# EAGLE schematic smps test (EAGLE 7.2.0)
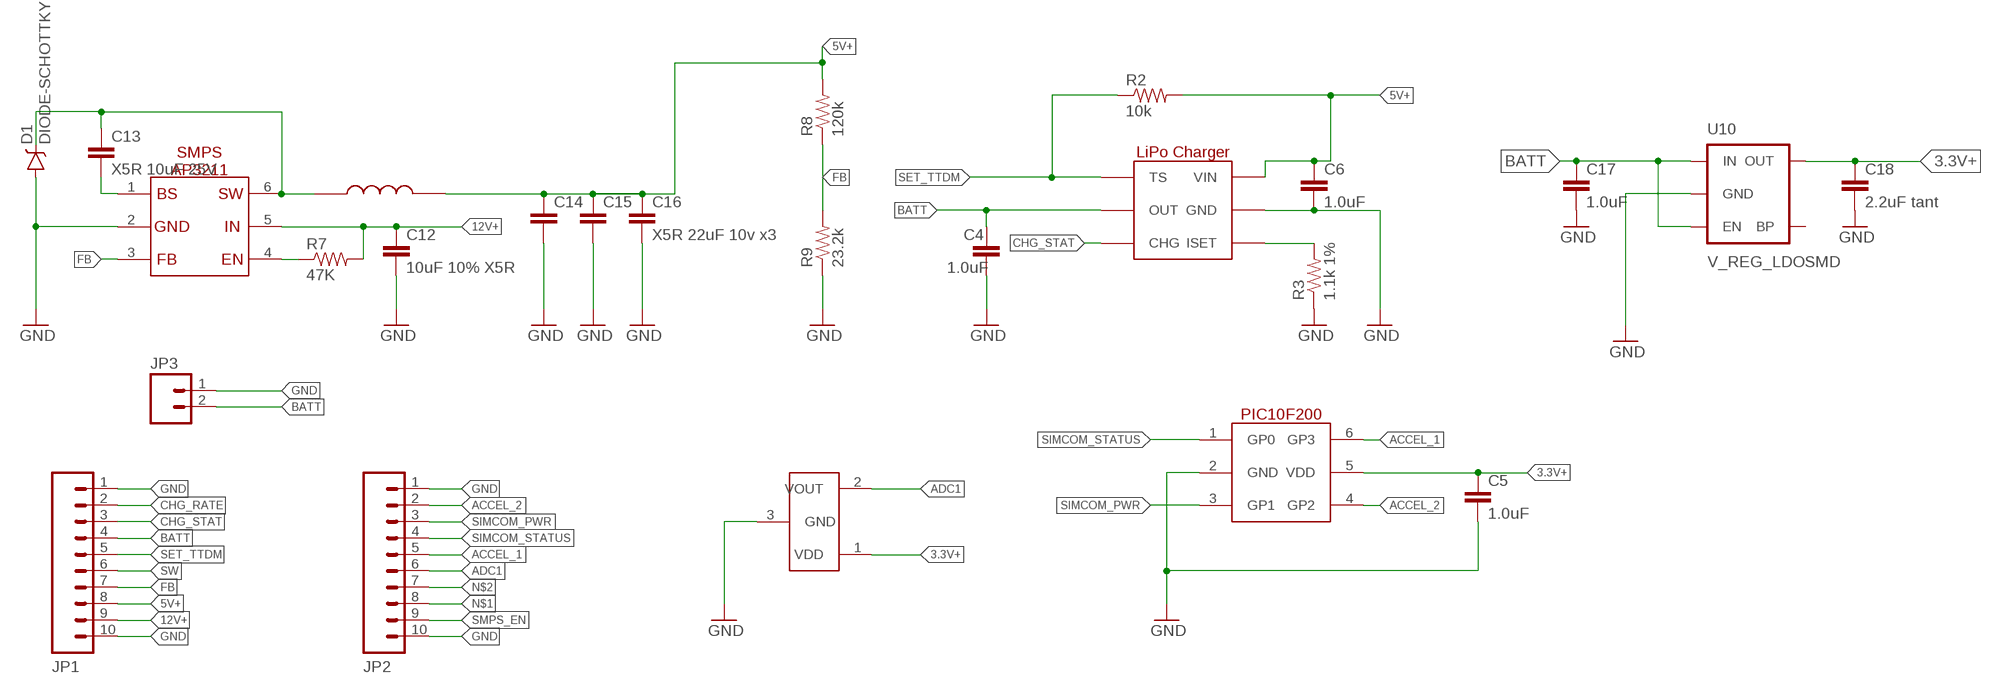
[diagram p0: schematic, sheet 1]

## Parts
C4  1.0uF  1.0UF-16V-10%(0603)  [0603-CAP]
C5  1.0uF  1.0UF-16V-10%(0603)  [0603-CAP]
C6  1.0uF  1.0UF-16V-10%(0603)  [0603-CAP]
C12  10uF 10% X5R  CAP1206  [1206]
C13  X5R 10uF 25V  CAP0603-CAP  [0603-CAP]
C14  CAP0603-CAP  [0603-CAP]
C15  CAP0603-CAP  [0603-CAP]
C16  X5R 22uF 10v x3  CAP0603-CAP  [0603-CAP]
C17  1.0uF  CAP0603-CAP  [0603-CAP]
C18  2.2uF tant  CAP0603-CAP  [0603-CAP]
D1  DIODE-SCHOTTKY  [MICRO_SMP]
JP1  M10LOCK  [1X10_LOCK]
JP2  M10LOCK  [1X10_LOCK]
JP3  M02-JST-2MM-SMT  [JST-2-SMD]
R2  10k  RESISTOR0603-RES  [0603-RES]
R3  1.1k 1%  RESISTOR0603-RES  [0603-RES]
R7  47K  47KOHM1/10W1%(0603)  [0603-RES]
R8  120k  RESISTOR0603  [0603-RES]
R9  23.2k  RESISTOR0603  [0603-RES]
U3  BQ21040  [SOT23-6]
U6  PIC10F200  [SOT23-6]
U10  V_REG_LDOSMD  [SOT23-5]
U$1  MCP9700T-E  [SOT23-3]
U$2  AP3211  [SOT23-6]
U$4  INDUCTOR  [INDUCTOR_FIXED]

## Nets
3.3V+: C5.1 C18.1 U6.5(VDD) U10.5(OUT) U$1.1(VDD)
5V+: C6.1 C14.1 C15.1 C16.1 JP1.8 R2.2 R8.2 U3.6(VIN) U$4.P$2
12V+: C12.1 JP1.9 R7.2 U$2.5
ACCEL_1: JP2.5 U6.6(GP3)
ACCEL_2: JP2.2 U6.4(GP2)
ADC1: JP2.6 U$1.2(VOUT)
BATT: C4.1 C17.1 JP1.4 JP3.2 U3.2(OUT) U10.1(IN) U10.3(EN)
CHG_RATE: JP1.2 R3.2 U3.4(ISET)
CHG_STAT: JP1.3 U3.3(CHG)
FB: JP1.7 R8.1 R9.2 U$2.3
GND: C4.2 C5.2 C6.2 C12.2 C14.2 C15.2 C16.2 C17.2 C18.2 D1.P$2(A) JP1.1 JP1.10 JP2.1 JP2.10 JP3.1 R3.1 R9.1 U3.5(GND) U6.2(GND) U10.2(GND) U$1.3(GND) U$2.2
N$1: JP2.8
N$2: JP2.7
N$6: C13.2 U$2.1
SET_TTDM: JP1.5 R2.1 U3.1(TS)
SIMCOM_PWR: JP2.3 U6.3(GP1)
SIMCOM_STATUS: JP2.4 U6.1(GP0)
SMPS_EN: JP2.9 R7.1 U$2.4
SW: C13.1 D1.P$1(C) JP1.6 U$2.6 U$4.P$1
Unconnected: U10.4(BP)

## Library data of the parts
C4-C6 = SparkFun-Capacitors:1.0UF-16V-10%(0603): CAP-00868; PROD_ID: CAP-00868
C12-C18 = SparkFun-Capacitors:CAP: Capacitor Standard 0603 ceramic capacitor, and 0.1" leaded capacitor.
D1 = SparkFun-DiscreteSemi:DIODE-SCHOTTKY: Schottky diodes in SFE's production catalog BAT20J 1A 23V 0.62Vf RB751 120mA 40V 0.37Vf PMEG4005EJ 0.5A 40V 0.42Vf MBRA140 1A 40V 0.5Vf B340A 3A 40V SMA
JP1 JP2 = SparkFun-Connectors:M10: Header 10 Standard 10-pin 0.1" header. Use with straight break away headers (SKU : PRT-00116), right angle break away headers (PRT-00553), swiss pins (PRT-00743), machine pins (PRT-00117), and female headers (PRT-00115).
JP3 = SparkFun-Connectors:M02: Standard 2-pin 0.1" header. Use with - straight break away headers ( PRT-00116) - right angle break away headers (PRT-00553) - swiss pins (PRT-00743) - machine pins (PRT-00117) - female headers (PRT-00115) Molex polarized connector foot print use with: PRT-08233 with associated crimp pins and housings. 2.54_SCREWTERM for use with PRT-10571. 3.5mm Screw Terminal footprints for PRT-08084 5mm Screw Terminal footprints for use with PRT-08432; PROD_ID: CONN-11443
R2 R3 = SparkFun-Passives:RESISTOR: Resistor Basic schematic elements and footprints for 0603, 1206, and PTH resistors.
R7 = SparkFun-Resistors:47KOHM1/10W1%(0603): RES-07871; PROD_ID: RES-07871
R8 R9 = SparkFun-Resistors:RESISTOR: Resistor Basic schematic elements and footprints for 0603, 1206, and PTH resistors.
U3 = SparkFun-DigitalIC:BQ21040: TI single cell lipo charger.
U6 = SparkFun-DigitalIC:PIC10F200
U10 = SparkFun-PowerIC:V_REG_LDO: Voltage Regulator LDO Standard 150mA LDO voltage regulator in SOT-23 layout. Micrel part MIC5205. BP (by-pass) pin is used to lower output noise with 470pF cap.
U$1 = SparkFun-AnalogIC:MCP9700T-E
U$2 = SparkFun-DigitalIC:AP3211
U$4 = User-Submitted:INDUCTOR